# Altium project SingleChip-Rev2.PrjPcb (part 4 of 8)

## Sheet FPGA IO.SchDoc: =ProjectTitle
size A3; Author: Jaime I. Chait; Organization: NWES LLC; Address1: 111 SW 5th Ave, STE 3150; Address2: Portland, OR 97204; DocumentNumber: SCH-0001; Revision: 2; SheetNumber: 11; SheetTotal: 19
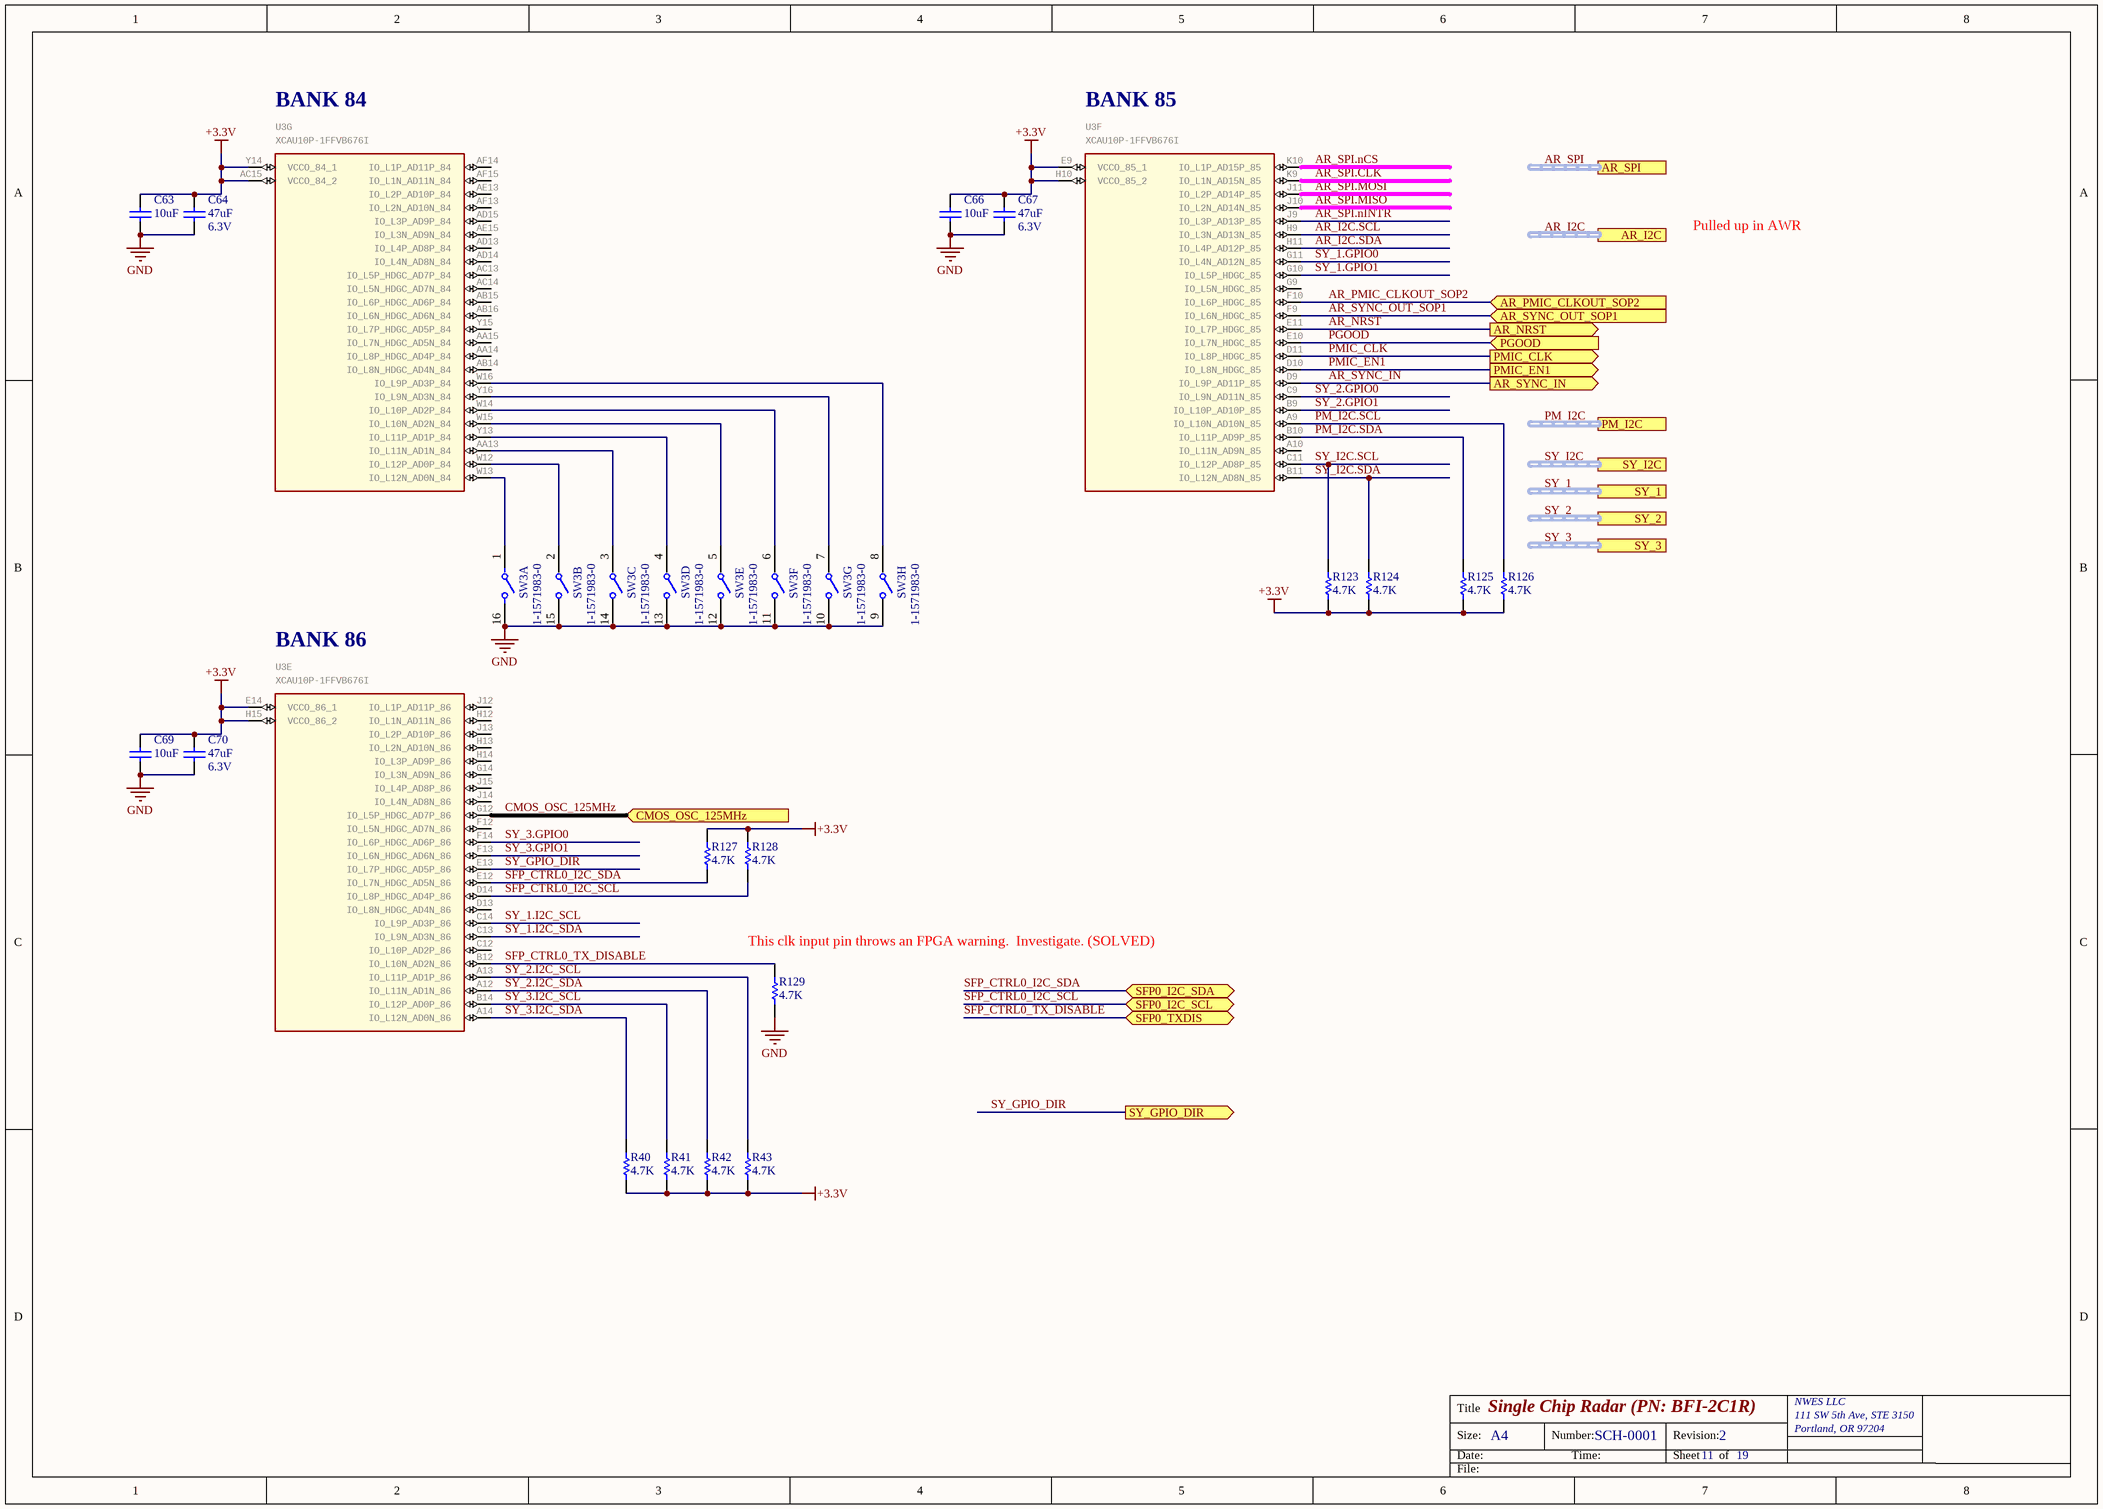
[diagram p10: FPGA IO.SchDoc]

### Parts
C63  10uF  [CAPC1005X90]
C64  47uF  Voltage Rating: 6.3V  [CAPC2012X145USR]
C66  10uF  [CAPC1005X90]
C67  47uF  Voltage Rating: 6.3V  [CAPC2012X145USR]
C69  10uF  [CAPC1005X90]
C70  47uF  Voltage Rating: 6.3V  [CAPC2012X145USR]
R40  4.7K  [RESC1005X40USR]
R41  4.7K  [RESC1005X40USR]
R42  4.7K  [RESC1005X40USR]
R43  4.7K  [RESC1005X40USR]
R123  4.7K  [RESC1005X40USR]
R124  4.7K  [RESC1005X40USR]
R125  4.7K  [RESC1005X40USR]
R126  4.7K  [RESC1005X40USR]
R127  4.7K  [RESC1005X40USR]
R128  4.7K  [RESC1005X40USR]
R129  4.7K  [RESC1005X40USR]
SW3  1-1571983-0  [FP-1-1571983-0-MFG]  (parts A,B,C,D,E,F,G,H of 8)
U3  XCAU10P-1FFVB676I  [676-FCBGA (27x27)]  (parts E,F,G of 16)

### Ports
AR_I2C (harness I2C), AR_NRST (out), AR_PMIC_CLKOUT_SOP2 (in), AR_SPI (harness SPI), AR_SYNC_IN (out), AR_SYNC_OUT_SOP1 (in), CMOS_OSC_125MHz (in), PGOOD (in), PM_I2C (harness I2C), PMIC_CLK (out), PMIC_EN1 (out), SFP0_I2C_SCL (bidir), SFP0_I2C_SDA (bidir), SFP0_TXDIS (bidir), SY_1 (harness GPIO group), SY_2 (harness GPIO group), SY_3 (harness GPIO group), SY_GPIO_DIR (out), SY_I2C (harness I2C)

### Nets
+3.3V: C63.2 C64.1 C66.2 C67.1 C69.2 C70.1 R40.2 R41.2 R42.2 R43.2 R123.1 R124.1 R125.1 R126.1 R127.1 R128.1 U3.AC15(VCCO_84_2) U3.E9(VCCO_85_1) U3.E14(VCCO_86_1) U3.H10(VCCO_85_2) U3.H15(VCCO_86_2) U3.Y14(VCCO_84_1)
GND: C63.1 C64.2 C66.1 C67.2 C69.1 C70.2 R129.2 SW3.9 SW3.10 SW3.11 SW3.12 SW3.13 SW3.14 SW3.15 SW3.16
AR_I2C.SCL: U3.H9(IO_L3N_AD13N_85)
AR_I2C.SDA: U3.H11(IO_L4P_AD12P_85)
AR_NRST: U3.E11(IO_L7P_HDGC_85) ; port AR_NRST
AR_PMIC_CLKOUT_SOP2: U3.F10(IO_L6P_HDGC_85) ; port AR_PMIC_CLKOUT_SOP2
AR_SPI.CLK: U3.K9(IO_L1N_AD15N_85)
AR_SPI.MISO: U3.J10(IO_L2N_AD14N_85)
AR_SPI.MOSI: U3.J11(IO_L2P_AD14P_85)
AR_SPI.nCS: U3.K10(IO_L1P_AD15P_85)
AR_SPI.nINTR: U3.J9(IO_L3P_AD13P_85)
AR_SYNC_IN: U3.D9(IO_L9P_AD11P_85) ; port AR_SYNC_IN
AR_SYNC_OUT_SOP1: U3.F9(IO_L6N_HDGC_85) ; port AR_SYNC_OUT_SOP1
CMOS_OSC_125MHz: U3.G12(IO_L5P_HDGC_AD7P_86) ; port CMOS_OSC_125MHz
PGOOD: U3.E10(IO_L7N_HDGC_85) ; port PGOOD
PM_I2C.SCL: R126.2 U3.A9(IO_L10N_AD10N_85)
PM_I2C.SDA: R125.2 U3.B10(IO_L11P_AD9P_85)
PMIC_CLK: U3.D11(IO_L8P_HDGC_85) ; port PMIC_CLK
PMIC_EN1: U3.D10(IO_L8N_HDGC_85) ; port PMIC_EN1
SFP_CTRL0_I2C_SCL: R128.2 U3.D14(IO_L8P_HDGC_AD4P_86) ; port SFP0_I2C_SCL
SFP_CTRL0_I2C_SDA: R127.2 U3.E12(IO_L7N_HDGC_AD5N_86) ; port SFP0_I2C_SDA
SFP_CTRL0_TX_DISABLE: R129.1 U3.B12(IO_L10N_AD2N_86) ; port SFP0_TXDIS
SY_1.GPIO0: U3.G11(IO_L4N_AD12N_85)
SY_1.GPIO1: U3.G10(IO_L5P_HDGC_85)
SY_1.I2C_SCL: U3.C14(IO_L9P_AD3P_86)
SY_1.I2C_SDA: U3.C13(IO_L9N_AD3N_86)
SY_2.GPIO0: U3.C9(IO_L9N_AD11N_85)
SY_2.GPIO1: U3.B9(IO_L10P_AD10P_85)
SY_2.I2C_SCL: R43.1 U3.A13(IO_L11P_AD1P_86)
SY_2.I2C_SDA: R42.1 U3.A12(IO_L11N_AD1N_86)
SY_3.GPIO0: U3.F14(IO_L6P_HDGC_AD6P_86)
SY_3.GPIO1: U3.F13(IO_L6N_HDGC_AD6N_86)
SY_3.I2C_SCL: R41.1 U3.B14(IO_L12P_AD0P_86)
SY_3.I2C_SDA: R40.1 U3.A14(IO_L12N_AD0N_86)
SY_GPIO_DIR: U3.E13(IO_L7P_HDGC_AD5P_86) ; port SY_GPIO_DIR
SY_I2C.SCL: R123.2 U3.C11(IO_L12P_AD8P_85)
SY_I2C.SDA: R124.2 U3.B11(IO_L12N_AD8N_85)
NetSW3_1: SW3.1 U3.W13(IO_L12N_AD0N_84)
NetSW3_2: SW3.2 U3.W12(IO_L12P_AD0P_84)
NetSW3_3: SW3.3 U3.AA13(IO_L11N_AD1N_84)
NetSW3_4: SW3.4 U3.Y13(IO_L11P_AD1P_84)
NetSW3_5: SW3.5 U3.W15(IO_L10N_AD2N_84)
NetSW3_6: SW3.6 U3.W14(IO_L10P_AD2P_84)
NetSW3_7: SW3.7 U3.Y16(IO_L9N_AD3N_84)
NetSW3_8: SW3.8 U3.W16(IO_L9P_AD3P_84)

Not connected (* = marked no-connect by the designer): U3 A10(IO_L11N_AD9N_85) AA14(IO_L8P_HDGC_AD4P_84) AA15(IO_L7N_HDGC_AD5N_84) AB14(IO_L8N_HDGC_AD4N_84) AB15(IO_L6P_HDGC_AD6P_84) AB16(IO_L6N_HDGC_AD6N_84) AC13(IO_L5P_HDGC_AD7P_84) AC14(IO_L5N_HDGC_AD7N_84) AD13(IO_L4P_AD8P_84) AD14(IO_L4N_AD8N_84) AD15(IO_L3P_AD9P_84) AE13(IO_L2P_AD10P_84) AE15(IO_L3N_AD9N_84) AF13(IO_L2N_AD10N_84) AF14(IO_L1P_AD11P_84) AF15(IO_L1N_AD11N_84) C12(IO_L10P_AD2P_86) D13(IO_L8N_HDGC_AD4N_86) F12(IO_L5N_HDGC_AD7N_86) G9(IO_L5N_HDGC_85) G14(IO_L3N_AD9N_86) H12(IO_L1N_AD11N_86) H13(IO_L2N_AD10N_86) H14(IO_L3P_AD9P_86) J12(IO_L1P_AD11P_86) J13(IO_L2P_AD10P_86) J14(IO_L4N_AD8N_86) J15(IO_L4P_AD8P_86) Y15(IO_L7P_HDGC_AD5P_84)

### Buses and harness runs
harness AR_I2C = port AR_I2C
harness AR_SPI = port AR_SPI
harness PM_I2C = port PM_I2C
harness SY_1 = port SY_1
harness SY_2 = port SY_2
harness SY_3 = port SY_3
harness SY_I2C = port SY_I2C

### Notes on the sheet
- Pulled up in AWR
- (near R129) This clk input pin throws an FPGA warning.  Investigate. (SOLVED)
- Title
- Size:
- Date:
- A4
- Number:
- Time:
- Revision:
- Sheet
- of
- File:
- (in symbol XCAU10P-1FFVB676I, part E) BANK 86
- (in symbol XCAU10P-1FFVB676I, part F) BANK 85
- (in symbol XCAU10P-1FFVB676I, part G) BANK 84

### Library data of the parts
C63 C66 C69 = CAP CER 10UF 10V X5R 0402: Manufacturer Part Number: CL05A106MP8NUB8; Manufacturer: Samsung Electro-Mechanics; Part #: E-CAP-042; Supplier Part Number 1: 1276-6830-2-ND; Package: 0402; value: 10uF; Supplier 1: Digi-Key; Height: 0.9mm; ComponentLink1Description: New link; ComponentLink1URL: *
C64 C67 C70 = CAP CER 47UF 6.3V X5R 0805: Manufacturer: Samsung; Manufacturer Part Number: CL21A476MQYNNNE; Tolerance: 20%; Supplier 1: Digi-Key; RoHS: Yes; Category: Ceramic Capacitors; Stock 1: 1673694; Pricing 1: 1=0.29000, 10=0.20200, 50=0.13440, 100=0.11420, 500=0.08064, 1000=0.07057 (USD); Mount: Surface Mount; Case/Package: 0805; Case Code (Metric): 2012; Case Code (Imperial): 0805; Contact Plating: Tin; Min Operating Temperature: -55°C; Max Operating Temperature: 85°C; Capacitance: 47uF; Package Quantity: 1; Packaging: Tape and Reel; Dielectric: X5R; Series: CL; Construction: Flat; Length: 2mm; Width: 0.049inch; Height: 1.25mm; Thickness: 0.057inch; Depth: 1.25mm; Radiation Hardening: No; RoHS Compliant: Yes; ComponentLink1URL: https://datasheet.ciiva.com/25791/cl21a476mqynnne-25791153.pdf?src-supplier=Digi-Key; ComponentLink1Description: https://datasheet.ciiva.com/25791/cl21a476mqynnne-25791153.pdf?src-supplier=Digi-Key; ComponentLink2URL: https://datasheet.ciiva.com/26838/getdatasheetpartid-359050-26838632.pdf?src-supplier=Verical; ComponentLink2Description: https://datasheet.ciiva.com/26838/getdatasheetpartid-359050-26838632.pdf?src-supplier=Verical; Supplier Part Number 1: 1276-1852-1-ND
R40-R43 R123-R129 = RES 4.7K OHM 1% 1/16W 0402: Manufacturer: YAGEO; Manufacturer Part Number: RC0402FR-074K7L; Supplier Part Number 1: 311-4.7KLRCT-ND; Supplier 1: Digi-Key; Height: 0.4mm; Package: 0402; value: 4.7K
SW3 = CMP-03400-000013-1: SWITCH SLIDE DIP SPST 25MA 24V; Manufacturer: TE Connectivity; Standoff Height: 0.1mm; Number Of Circuits: 8; Contact Resistance: 100mΩ; Electromechanical Life: 1000Cycles; Temperature: -30°C to +85°C; RoHS: TRUE; Automotive: No; Height: 2.56mm; Temperature Range Low: -30°C; Device Class L3: DIP Switches; Temperature Range High: +85°C; Category: Switch; Throw Configuration: SPST; Digikey Description: SWITCH SLIDE DIP SPST 25MA 24V; Octopart: https://octopart.com/1-1571983-0-te+connectivity-46507283; ComponentLink2Description: Datasheet; Voltage Rating Dc: 24V; Device Class L1: Electromechanical; ComponentLink2URL: https://www.te.com/commerce/DocumentDelivery/DDEController?Action=srchrtrv&DocNm=1571983&DocType=Customer+Drawing&DocLang=English; Manufacturer Part Number: 1-1571983-0; Package: 1-1571983-0; Device Class L2: Switches; Contact Current Rating: 25mA; Lead Free: Yes
U3 = XCAU10P-1FFVB676I: IC FPGA ARTIXUP 676BGA; Manufacturer: AMD Xilinx; Manufacturer Part Number: XCAU10P-1FFVB676I; Supplier Part Number 1: 122-XCAU10P-1FFVB676I-ND; Supplier 1: Supplier